# Altium schematic sheet ПАЯЛЬНЫЕ МАСКИ.SchDoc
size 594 x 420 mm; Address1: Address1; Address2: Address2; Address3: Address3; Address4: Address4; SheetNumber: 1; Scale: 1:1; Обозначение документа: АБВГ.123456.001 Э3
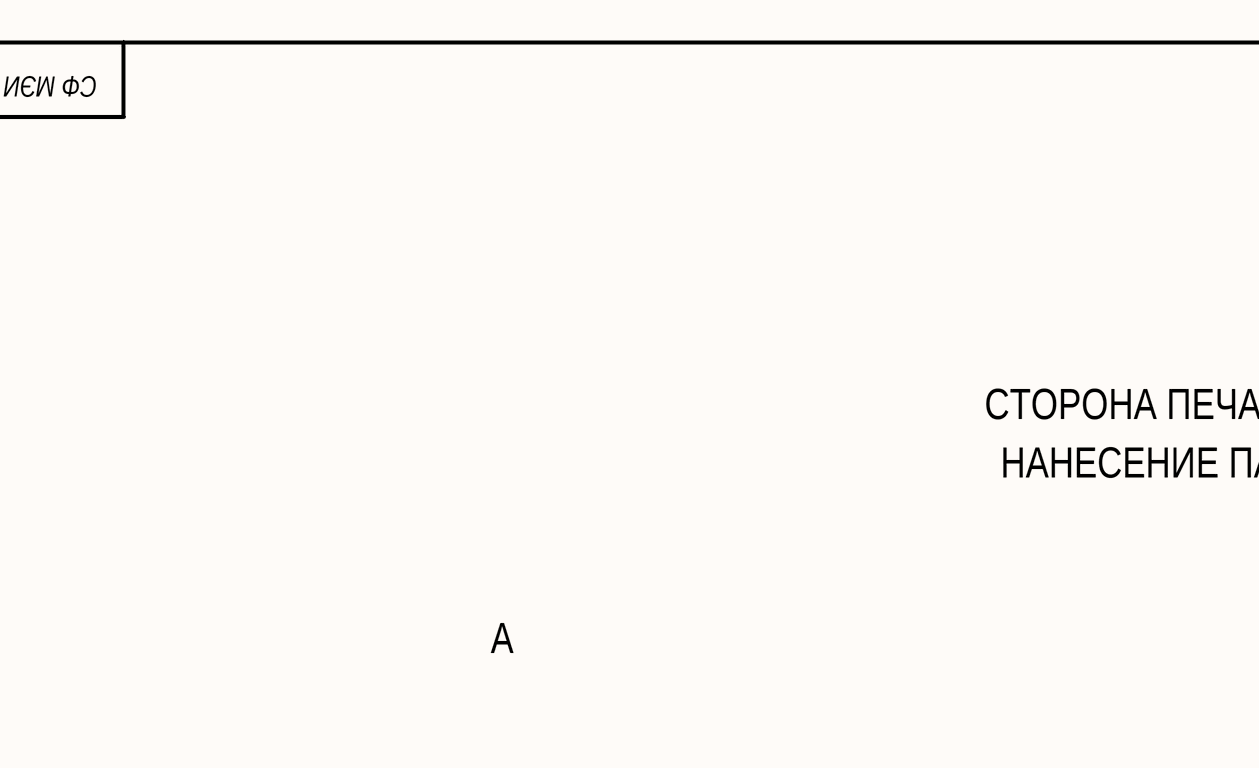
[diagram p0: ПАЯЛЬНЫЕ МАСКИ.SchDoc, top left]
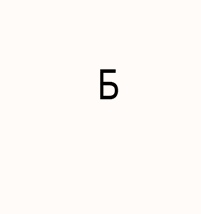
[diagram p1: ПАЯЛЬНЫЕ МАСКИ.SchDoc, top right]
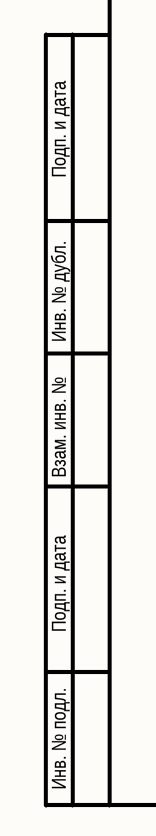
[diagram p2: ПАЯЛЬНЫЕ МАСКИ.SchDoc, bottom left]
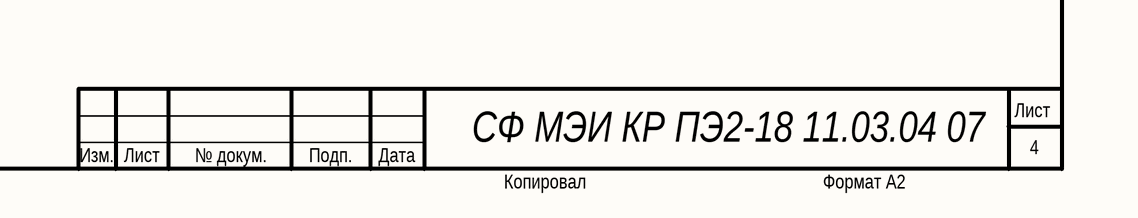
[diagram p3: ПАЯЛЬНЫЕ МАСКИ.SchDoc, bottom right]

## Notes on the sheet
- СФ МЭИ КР ПЭ2-18 11.03.04 07
- СТОРОНА ПЕЧАТНОГО МОНТАЖА
- НАНЕСЕНИЕ ПАЯЛЬНЫХ МАСОК
- Б
- А
- Подп. и дата
- Инв. № дубл.
- Взам. инв. №
- Инв. № подл.
- Изм.
- Лист
- № докум.
- Подп.
- Дата
- 4
- Копировал
- Формат А2